# EAGLE board Re.Cycle (EAGLE 5.11)
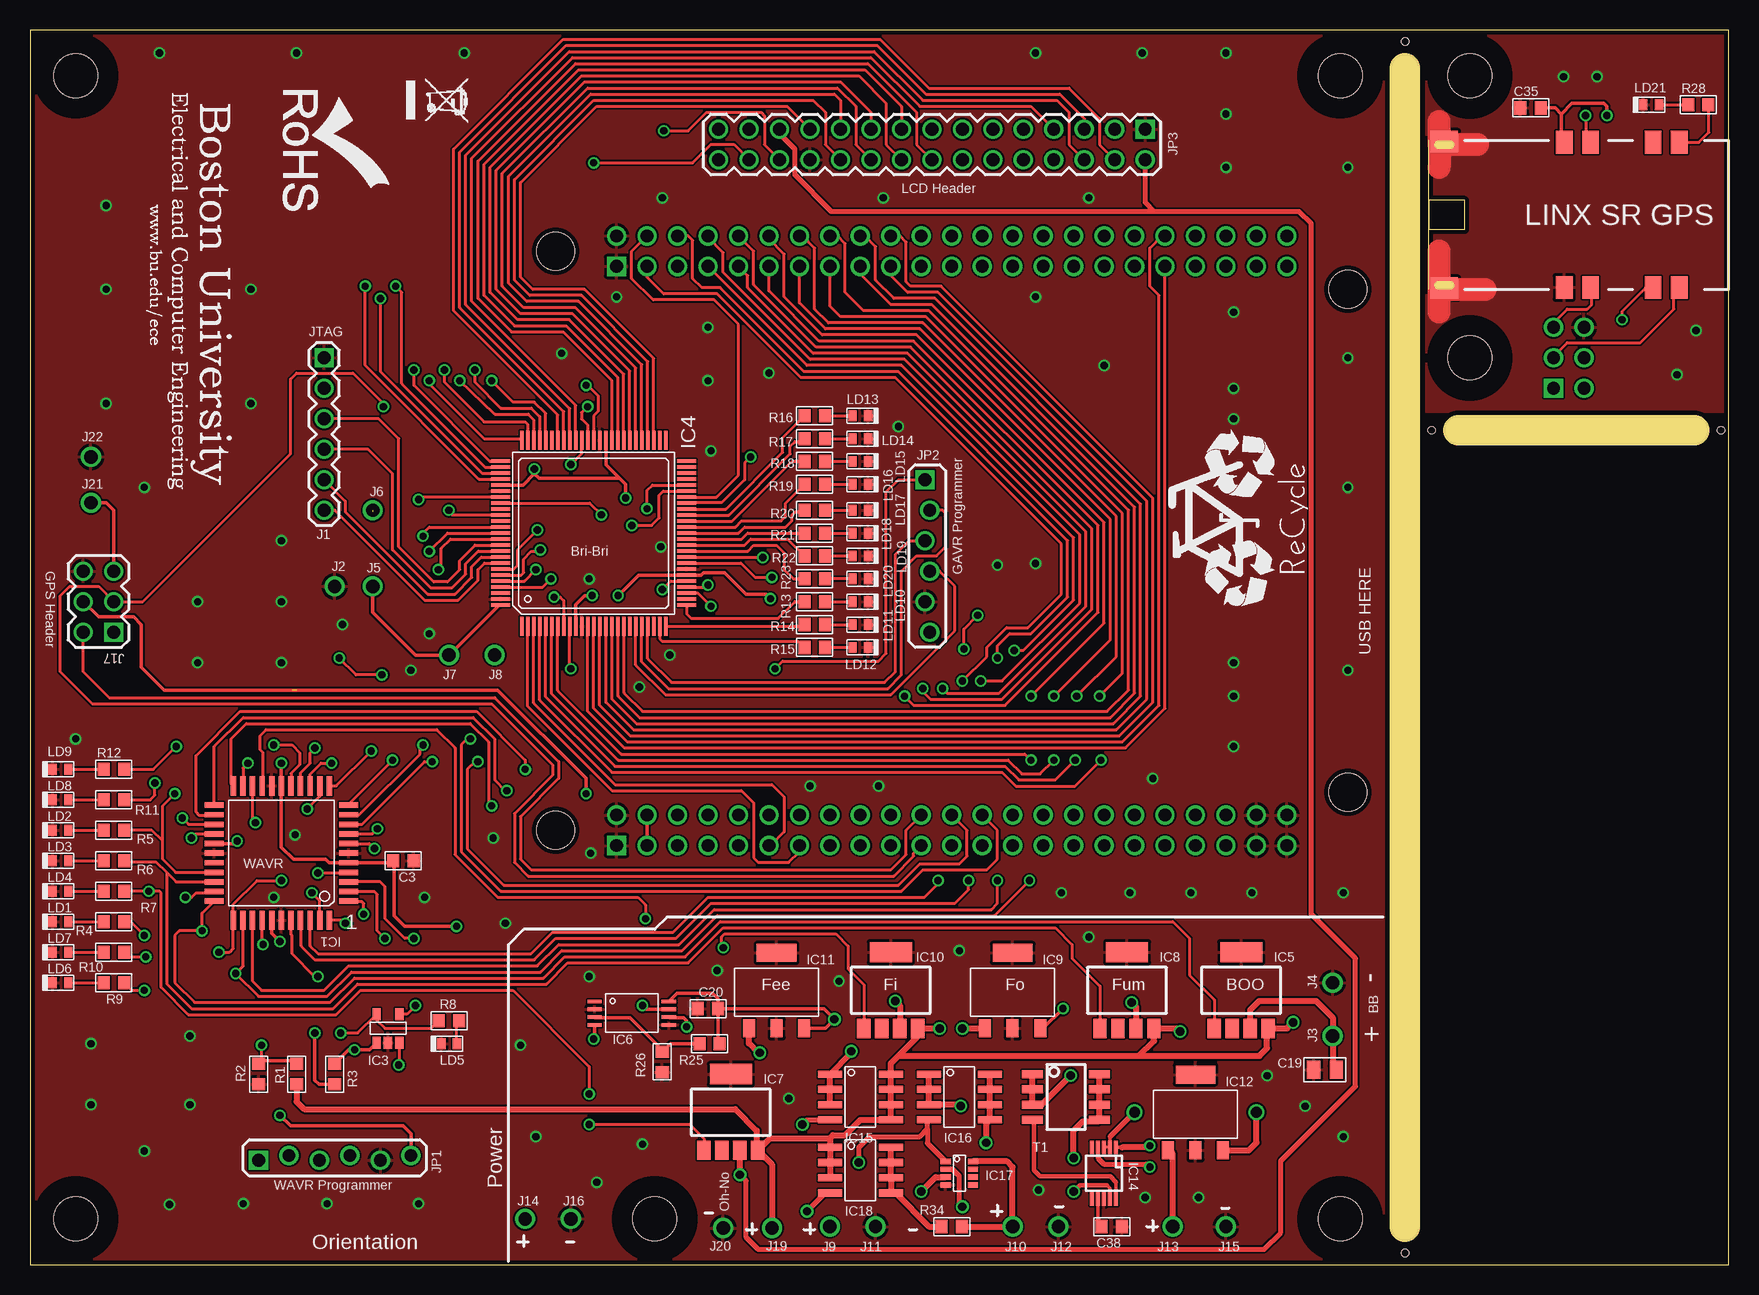
[diagram p4: board, top side]
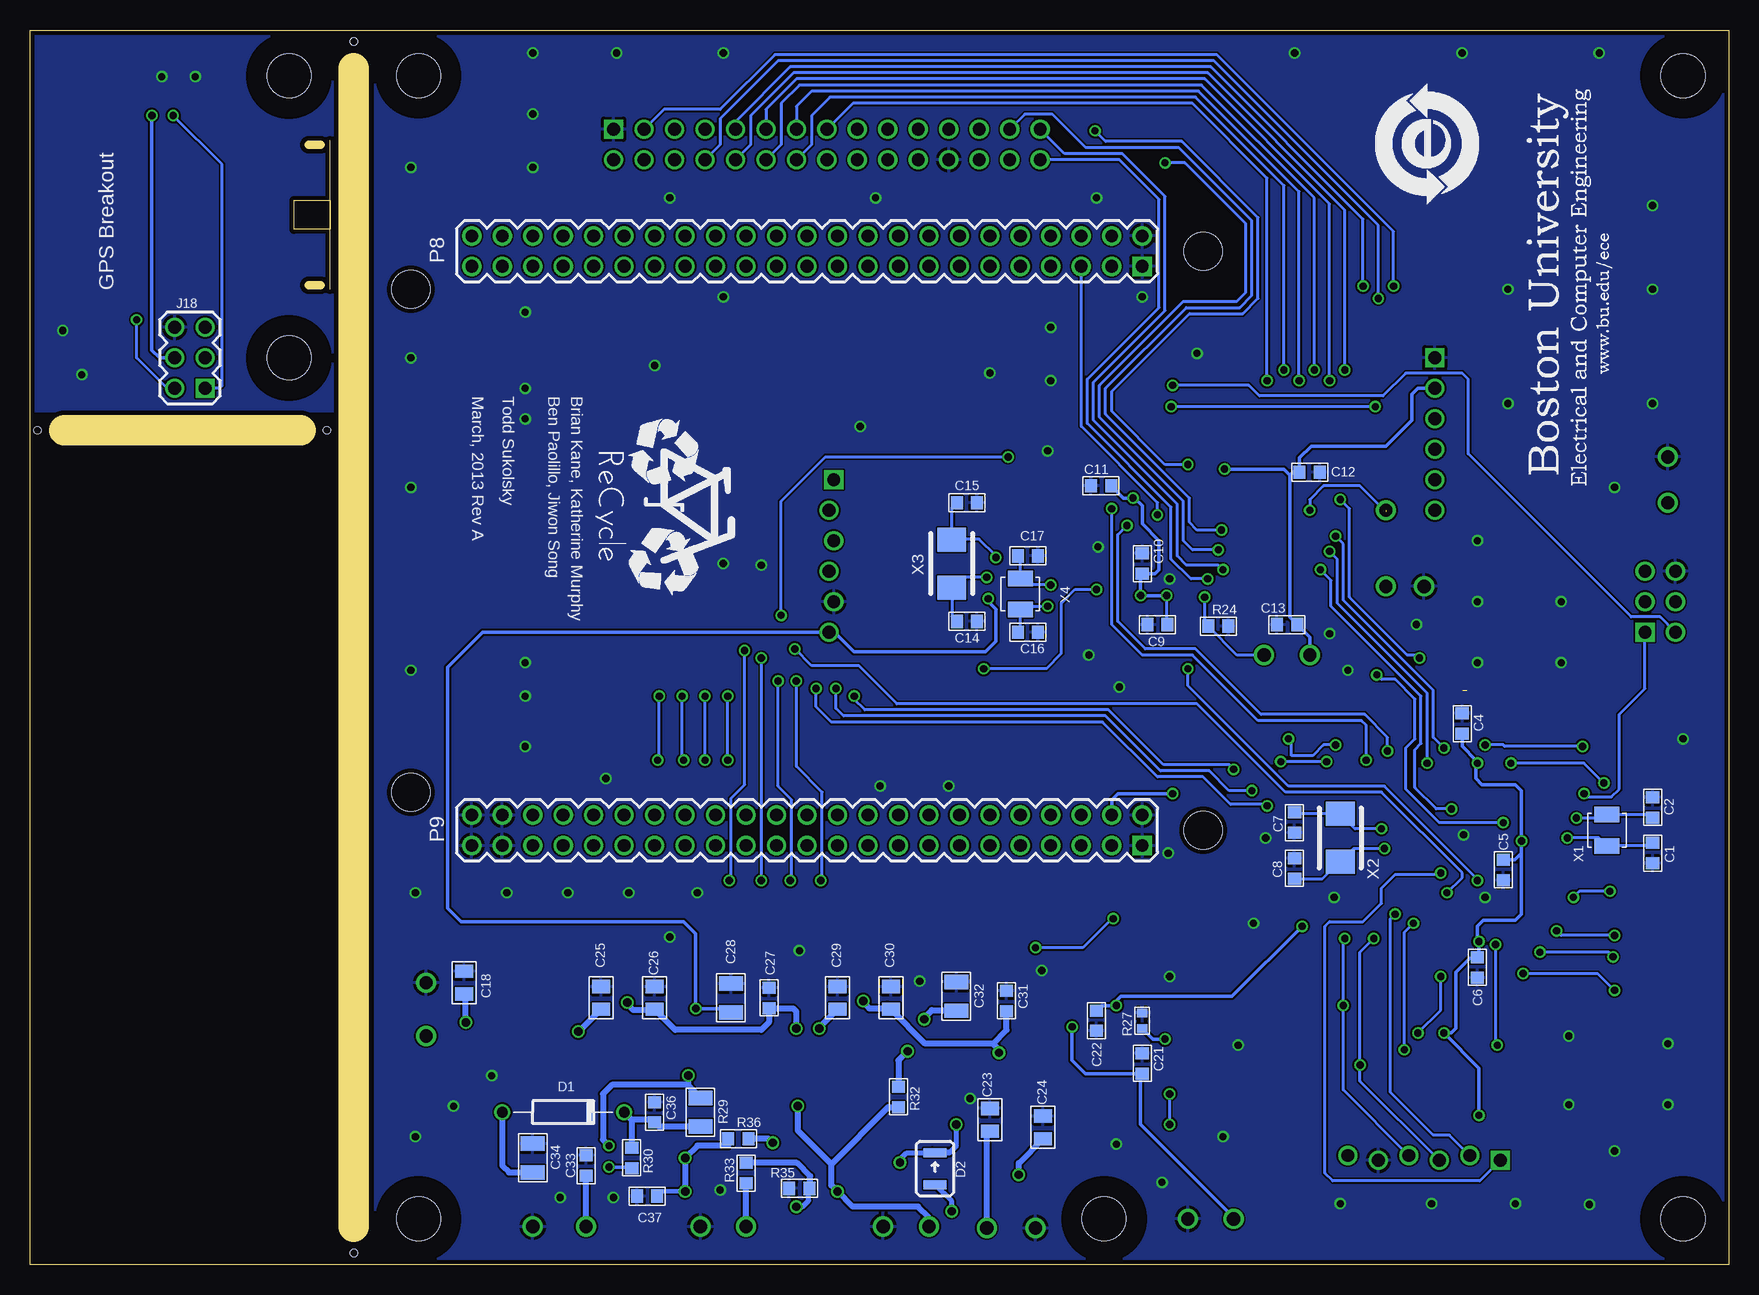
[diagram p5: board, bottom side, seen from below]

Size 141.6 x 102.89 mm. Coordinates in mm from the lower left corner, seen from the top.
Outline: 114.62,99.69 114.62,3.17
Outline: 138.75,69.53 119.06,69.53
Outline: 0,0 141.6,0 141.6,102.89 0,102.89 0,0
Copper layers (1*16): Top 0.0356mm / dielectric 1.5011mm / Bottom 0.0356mm
Design rules "oshPark": minimum track width 6mil, minimum drill 13mil, track to track 6mil, track to pad 6mil, pad to pad 6mil, via to via 6mil, smd to smd 6mil, copper to edge 15mil, drill to drill 6mil, minimum pad ring 7mil, minimum via ring 7mil, stop-mask expansion 4mil, vias tented up to drill 0mil, thermal gap 10mil
Holes 0.6 mm at 116.84,69.53 140.97,69.53 114.62,101.92 114.62,0.95

## Footprints (pad centres in the part's own frame; a part is rotated, then mirrored left to right if it is on the bottom)
C0603 = smd 1 x 1.1: 1 -0.85,0; 2 0.85,0
C0805 = smd 1.1 x 1.5: 1 -0.95,0; 2 0.95,0
C1206 = smd 1.2 x 2: 1 -1.2,0; 2 1.2,0
DO35 = drill 0.889 round: A 5.08,0; C -5.08,0
DO-213AC = smd 0.762 x 1.905: 1 -1.333,0; 2 1.333,0
FOOT#6 = hole 3.658: 0,0
TQFP44 = smd 1.6 x 0.45: 1 -5.6,4; 2 -5.6,3.2; 3 -5.6,2.4; 4 -5.6,1.6; 5 -5.6,0.8; 6 -5.6,0; 7 -5.6,-0.8; 8 -5.6,-1.6; 9 -5.6,-2.4; 10 -5.6,-3.2; 11 -5.6,-4; 23 5.6,-4; 24 5.6,-3.2; 25 5.6,-2.4; 26 5.6,-1.6; 27 5.6,-0.8; 28 5.6,0; 29 5.6,0.8; 30 5.6,1.6; 31 5.6,2.4; 32 5.6,3.2; 33 5.6,4 | smd 0.45 x 1.6: 12 -4,-5.6; 13 -3.2,-5.6; 14 -2.4,-5.6; 15 -1.6,-5.6; 16 -0.8,-5.6; 17 0,-5.6; 18 0.8,-5.6; 19 1.6,-5.6; 20 2.4,-5.6; 21 3.2,-5.6; 22 4,-5.6; 34 4,5.6; 35 3.2,5.6; 36 2.4,5.6; 37 1.6,5.6; 38 0.8,5.6; 39 0,5.6; 40 -0.8,5.6; 41 -1.6,5.6; 42 -2.4,5.6; 43 -3.2,5.6; 44 -4,5.6
BEAGLE_BONE_CAPE = drill 1.067 square: P8_1 -55.88,48.26; P9_1 -55.88,0 | drill 1.067 round: P8_2 -55.88,50.8; P8_3 -53.34,48.26; P8_4 -53.34,50.8; P8_5 -50.8,48.26; P8_6 -50.8,50.8; P8_7 -48.26,48.26; P8_8 -48.26,50.8; P8_9 -45.72,48.26; P8_10 -45.72,50.8; P8_11 -43.18,48.26; P8_12 -43.18,50.8; P8_13 -40.64,48.26; P8_14 -40.64,50.8; P8_15 -38.1,48.26; P8_16 -38.1,50.8; P8_17 -35.56,48.26; P8_18 -35.56,50.8; P8_19 -33.02,48.26; P8_20 -33.02,50.8; P8_21 -30.48,48.26; P8_22 -30.48,50.8; P8_23 -27.94,48.26; P8_24 -27.94,50.8; P8_25 -25.4,48.26; P8_26 -25.4,50.8; P8_27 -22.86,48.26; P8_28 -22.86,50.8; P8_29 -20.32,48.26; P8_30 -20.32,50.8; P8_31 -17.78,48.26; P8_32 -17.78,50.8; P8_33 -15.24,48.26; P8_34 -15.24,50.8; P8_35 -12.7,48.26; P8_36 -12.7,50.8; P8_37 -10.16,48.26; P8_38 -10.16,50.8; P8_39 -7.62,48.26; P8_40 -7.62,50.8; P8_41 -5.08,48.26; P8_42 -5.08,50.8; P8_43 -2.54,48.26; P8_44 -2.54,50.8; P8_45 0,48.26; P8_46 0,50.8; P9_2 -55.88,2.54; P9_3 -53.34,0; P9_4 -53.34,2.54; P9_5 -50.8,0; P9_6 -50.8,2.54; P9_7 -48.26,0; P9_8 -48.26,2.54; P9_9 -45.72,0; P9_10 -45.72,2.54; P9_11 -43.18,0; P9_12 -43.18,2.54; P9_13 -40.64,0; P9_14 -40.64,2.54; P9_15 -38.1,0; P9_16 -38.1,2.54; P9_17 -35.56,0; P9_18 -35.56,2.54; P9_19 -33.02,0; P9_20 -33.02,2.54; P9_21 -30.48,0; P9_22 -30.48,2.54; P9_23 -27.94,0; P9_24 -27.94,2.54; P9_25 -25.4,0; P9_26 -25.4,2.54; P9_27 -22.86,0; P9_28 -22.86,2.54; P9_29 -20.32,0; P9_30 -20.32,2.54; P9_31 -17.78,0; P9_32 -17.78,2.54; P9_33 -15.24,0; P9_34 -15.24,2.54; P9_35 -12.7,0; P9_36 -12.7,2.54; P9_37 -10.16,0; P9_38 -10.16,2.54; P9_39 -7.62,0; P9_40 -7.62,2.54; P9_41 -5.08,0; P9_42 -5.08,2.54; P9_43 -2.54,0; P9_44 -2.54,2.54; P9_45 0,0; P9_46 0,2.54 | hole 3.175: -60.96,49.53; 5.08,46.355; 5.08,4.445; -60.96,1.27
SOT23-5 = smd 0.7 x 1: 1 -0.95,-1.2; 2 0,-1.2; 3 0.95,-1.2; 4 0.95,1.2; 5 -0.95,1.2
TQFP100-100A = smd 1.6 x 0.3: 1 -7.75,6; 2 -7.75,5.5; 3 -7.75,5; 4 -7.75,4.5; 5 -7.75,4; 6 -7.75,3.5; 7 -7.75,3; 8 -7.75,2.5; 9 -7.75,2; 10 -7.75,1.5; 11 -7.75,1; 12 -7.75,0.5; 13 -7.75,0; 14 -7.75,-0.5; 15 -7.75,-1; 16 -7.75,-1.5; 17 -7.75,-2; 18 -7.75,-2.5; 19 -7.75,-3; 20 -7.75,-3.5; 21 -7.75,-4; 22 -7.75,-4.5; 23 -7.75,-5; 24 -7.75,-5.5; 25 -7.75,-6; 51 7.75,-6; 52 7.75,-5.5; 53 7.75,-5; 54 7.75,-4.5; 55 7.75,-4; 56 7.75,-3.5; 57 7.75,-3; 58 7.75,-2.5; 59 7.75,-2; 60 7.75,-1.5; 61 7.75,-1; 62 7.75,-0.5; 63 7.75,0; 64 7.75,0.5; 65 7.75,1; 66 7.75,1.5; 67 7.75,2; 68 7.75,2.5; 69 7.75,3; 70 7.75,3.5; 71 7.75,4; 72 7.75,4.5; 73 7.75,5; 74 7.75,5.5; 75 7.75,6 | smd 0.3 x 1.6: 26 -6,-7.75; 27 -5.5,-7.75; 28 -5,-7.75; 29 -4.5,-7.75; 30 -4,-7.75; 31 -3.5,-7.75; 32 -3,-7.75; 33 -2.5,-7.75; 34 -2,-7.75; 35 -1.5,-7.75; 36 -1,-7.75; 37 -0.5,-7.75; 38 0,-7.75; 39 0.5,-7.75; 40 1,-7.75; 41 1.5,-7.75; 42 2,-7.75; 43 2.5,-7.75; 44 3,-7.75; 45 3.5,-7.75; 46 4,-7.75; 47 4.5,-7.75; 48 5,-7.75; 49 5.5,-7.75; 50 6,-7.75; 76 6,7.75; 77 5.5,7.75; 78 5,7.75; 79 4.5,7.75; 80 4,7.75; 81 3.5,7.75; 82 3,7.75; 83 2.5,7.75; 84 2,7.75; 85 1.5,7.75; 86 1,7.75; 87 0.5,7.75; 88 0,7.75; 89 -0.5,7.75; 90 -1,7.75; 91 -1.5,7.75; 92 -2,7.75; 93 -2.5,7.75; 94 -3,7.75; 95 -3.5,7.75; 96 -4,7.75; 97 -4.5,7.75; 98 -5,7.75; 99 -5.5,7.75; 100 -6,7.75
SOT223-5 = smd 1.1 x 1.6: 1 -2.25,-3.175; 2 -0.75,-3.175; 3 0.75,-3.175; 4 2.25,-3.175 | smd 3.5 x 1.7: TAB 0,3.175
TSSOP8 = smd 0.3 x 1.2: 1 -0.975,-3.1; 2 -0.325,-3.1; 3 0.325,-3.1; 4 0.975,-3.1; 5 0.975,3.1; 6 0.325,3.1; 7 -0.325,3.1; 8 -0.975,3.1
SOT223 = smd 1 x 1.5: 1 -2.3,0; 2 0,0; 3 2.3,0 | smd 3.3 x 1.5: TAB 0,6.3
SR-GPS = smd 1.9 x 1.4: 1 0.15,-11.3; 2 0.15,-13.5; 3 0.15,-18.7; 4 0.15,-20.9; 5 12.25,-20.9; 6 12.25,-18.7; 7 12.25,-13.5; 8 12.25,-11.3 | smd 1.8 x 2.3: 9 12.3,-1.3; 10 0.1,-1.3
MSOP10-UN = smd 0.33 x 1.1: 1 -1,-2.15; 2 -0.5,-2.15; 3 0,-2.15; 4 0.5,-2.15; 5 1,-2.15; 6 1,2.15; 7 0.5,2.15; 8 0,2.15; 9 -0.5,2.15; 10 -1,2.15
SO8 = smd 2 x 0.6: 1 -2.54,1.905; 2 -2.54,0.635; 3 -2.54,-0.635; 4 -2.54,-1.905; 5 2.54,-1.905; 6 2.54,-0.635; 7 2.54,0.635; 8 2.54,1.905
SOT23-8 = smd 0.45 x 0.85: 1 -0.975,-1.137; 2 -0.325,-1.137; 3 0.325,-1.137; 4 0.975,-1.137; 5 0.975,1.137; 6 0.325,1.137; 7 -0.325,1.137; 8 -0.975,1.137
HDR-1X6 = drill 1.067 square: 1 0,6.35 | drill 1.067 round: 2 0,3.81; 3 0,1.27; 4 0,-1.27; 5 0,-3.81; 6 0,-6.35
18AWG-SOLDERPOINT = drill 1.1 pad 1.676 round: 1 0,0
HDR-2X3 = drill 1.067 square: 1 -1.27,2.54 | drill 1.067 round: 2 1.27,2.54; 3 -1.27,0; 4 1.27,0; 5 -1.27,-2.54; 6 1.27,-2.54
HDR-1X6_OFFSET = drill 1.067 square: 1 -0.203,6.35 | drill 1.067 round: 2 0.203,3.81; 3 -0.203,1.27; 4 0.203,-1.27; 5 -0.203,-3.81; 6 0.203,-6.35
HDR-2X15 = drill 1.067 square: 1 -1.27,19.05 | drill 1.067 round: 2 1.27,19.05; 3 -1.27,16.51; 4 1.27,16.51; 5 -1.27,13.97; 6 1.27,13.97; 7 -1.27,11.43; 8 1.27,11.43; 9 -1.27,8.89; 10 1.27,8.89; 11 -1.27,6.35; 12 1.27,6.35; 13 -1.27,3.81; 14 1.27,3.81; 15 -1.27,1.27; 16 1.27,1.27; 17 -1.27,-1.27; 18 1.27,-1.27; 19 -1.27,-3.81; 20 1.27,-3.81; 21 -1.27,-6.35; 22 1.27,-6.35; 23 -1.27,-8.89; 24 1.27,-8.89; 25 -1.27,-11.43; 26 1.27,-11.43; 27 -1.27,-13.97; 28 1.27,-13.97; 29 -1.27,-16.51; 30 1.27,-16.51
D0402 = smd 0.7 x 0.9: A 0.65,0; C -0.65,0
R0603 = smd 1 x 1.1: 1 -0.85,0; 2 0.85,0
R0402 = smd 0.7 x 0.9: 1 -0.65,0; 2 0.65,0
R1206 = smd 1.2 x 2: 1 -1.2,0; 2 1.2,0
SOIC8 = smd 0.65 x 1.75: 1 -1.905,-2.8; 2 -0.635,-2.8; 3 0.635,-2.8; 4 1.905,-2.8; 5 1.905,2.8; 6 0.635,2.8; 7 -0.635,2.8; 8 -1.905,2.8
ABS07 = smd 1.3 x 2.1: 1 -1.3,0; 2 1.3,0
TXC-7A-SERIES = smd 2 x 2.4: P$1 -2,0; P$2 2,0

## Placement (x,y rotation side)
C1  6pF  [C0603]  6.35,34.29 270 bottom
C2  6pF  [C0603]  6.35,38.1 90 bottom
C3  4.7uF  [C0603]  31.11,33.66 0 top
C4  .1uF  [C0603]  22.23,45.09 90 bottom
C5  .1uF  [C0603]  18.8,32.89 270 bottom
C6  .1uF  [C0603]  20.95,24.77 270 bottom
C7  18pF  [C0603]  36.2,36.83 270 bottom
C8  18pF  [C0603]  36.2,33.02 90 bottom
C9  4.7uF  [C0603]  47.62,53.34 180 bottom
C10  .1uF  [C0603]  48.9,58.42 90 bottom
C11  .1uF  [C0603]  52.32,64.9 180 bottom
C12  .1uF  [C0603]  34.92,66.04 0 bottom
C13  .1uF  [C0603]  36.83,53.34 180 bottom
C14  18pF  [C0603]  63.5,53.59 0 bottom
C15  18pF  [C0603]  63.5,63.5 0 bottom
C16  6pF  [C0603]  58.42,52.7 0 bottom
C17  6pF  [C0603]  58.42,59.05 0 bottom
C18  10uF  [C0805]  105.41,23.5 90 bottom
C19  10uF  [C0805]  107.95,16.26 180 top
C20  .1uF  [C0603]  56.52,21.34 180 top
C21  .1uF  [C0603]  48.9,16.76 90 bottom
C22  .1uF  [C0603]  52.7,20.32 270 bottom
C23  10uF  [C0805]  61.59,12.06 90 bottom
C24  10uF  [C0805]  57.15,11.43 90 bottom
C25  10uF  [C0805]  93.98,22.23 90 bottom
C26  10uF  [C0805]  89.53,22.23 90 bottom
C27  1uF  [C0603]  80.01,22.23 90 bottom
C28  47uF  [C1206]  83.19,22.23 90 bottom
C29  10uF  [C0805]  74.3,22.23 90 bottom
C30  10uF  [C0805]  69.85,22.23 90 bottom
C31  1uF  [C0603]  60.2,21.97 90 bottom
C32  47uF  [C1206]  64.39,22.35 90 bottom
C33  1uF  [C0603]  95.25,8.26 90 bottom
C34  47uF  [C1206]  99.69,8.89 90 bottom
C35  .1uF  [C0603]  125.09,96.39 180 top
C36  4.7uF  [C0603]  89.53,12.7 90 bottom
C37  4.7uF  [C0603]  90.17,5.71 180 bottom
C38  4.7uF  [C0603]  90.17,3.17 0 top
D1  ZENER-DO35  [DO35]  97.16,12.7 180 bottom
D2  ZENER-213AC  [DO-213AC]  66.17,8 90 bottom
F1  FOOT  [FOOT#6]  120.02,75.56 0 top
F2  FOOT  [FOOT#6]  120.02,99.06 0 top
F5  FOOT  [FOOT#6]  3.81,3.81 0 top
F6  FOOT  [FOOT#6]  52.07,3.81 0 top
F7  FOOT  [FOOT#6]  109.22,3.81 0 top
F8  FOOT  [FOOT#6]  109.22,99.08 0 top
F10  FOOT  [FOOT#6]  3.81,99.08 0 top
IC1  ATMEGA1284P-AU  [TQFP44]  20.95,34.29 180 top
IC2  BEAGLE_BONE_CAPE-HEADER_ONLY  [BEAGLE_BONE_CAPE]  104.78,34.92 0 top
IC3  LM95071  [SOT23-5]  29.84,19.68 0 top
IC4  ATMEGA2560-16AU  [TQFP100-100A]  46.99,60.96 90 top
IC5  LP38692  [SOT223-5]  100.97,22.86 0 top
IC6  TPS2110  [TSSOP8]  50.16,20.95 270 top
IC7  LP38692  [SOT223-5]  58.42,12.7 0 top
IC8  LP38692  [SOT223-5]  91.44,22.86 0 top
IC9  LM3940  [SOT223]  81.92,19.68 0 top
IC10  LP38692  [SOT223-5]  71.75,22.86 0 top
IC11  LM3940  [SOT223]  62.23,19.68 0 top
IC12  LM2940-SOT223  [SOT223]  97.16,9.53 0 top
IC13  SR-GPS-SR-GPS  [SR-GPS]  116.59,81.28 90 top
IC14  MCP73842  [MSOP10-UN]  89.53,7.62 180 top
IC15  IRF9335-SO8  [SO8]  69.22,13.97 0 top
IC16  IRF8707  [SO8]  77.47,13.97 0 top
IC17  LTC6702  [SOT23-8]  77.47,7.62 270 top
IC18  IRF8707  [SO8]  69.22,7.87 0 top
J1  HDR-1X6  [HDR-1X6]  24.51,69.22 0 top
J2  HDR-1X1-18AWG_WIRE  [18AWG-SOLDERPOINT]  25.4,56.52 0 top
J3  HDR-1X1-18AWG_WIRE  [18AWG-SOLDERPOINT]  108.58,19.05 90 top
J4  HDR-1X1-18AWG_WIRE  [18AWG-SOLDERPOINT]  108.58,23.5 90 top
J5  HDR-1X1-18AWG_WIRE  [18AWG-SOLDERPOINT]  28.57,56.52 0 top
J6  HDR-1X1-18AWG_WIRE  [18AWG-SOLDERPOINT]  28.57,62.87 0 top
J7  HDR-1X1-18AWG_WIRE  [18AWG-SOLDERPOINT]  34.92,50.8 0 top
J8  HDR-1X1-18AWG_WIRE  [18AWG-SOLDERPOINT]  38.73,50.8 0 top
J9  HDR-1X1-18AWG_WIRE  [18AWG-SOLDERPOINT]  66.67,3.17 90 top
J10  HDR-1X1-18AWG_WIRE  [18AWG-SOLDERPOINT]  81.92,3.17 90 top
J11  HDR-1X1-18AWG_WIRE  [18AWG-SOLDERPOINT]  70.48,3.17 90 top
J12  HDR-1X1-18AWG_WIRE  [18AWG-SOLDERPOINT]  85.72,3.17 90 top
J13  HDR-1X1-18AWG_WIRE  [18AWG-SOLDERPOINT]  95.25,3.17 90 top
J14  HDR-1X1-18AWG_WIRE  [18AWG-SOLDERPOINT]  41.27,3.81 90 top
J15  HDR-1X1-18AWG_WIRE  [18AWG-SOLDERPOINT]  99.69,3.17 90 top
J16  HDR-1X1-18AWG_WIRE  [18AWG-SOLDERPOINT]  45.09,3.81 90 top
J17  HDR-2X3  [HDR-2X3]  5.71,55.24 180 top
J18  HDR-2X3  [HDR-2X3]  128.27,75.56 180 bottom
J19  HDR-1X1-18AWG_WIRE  [18AWG-SOLDERPOINT]  61.85,3.05 0 top
J20  HDR-1X1-18AWG_WIRE  [18AWG-SOLDERPOINT]  57.78,3.05 0 top
J21  HDR-1X1-18AWG_WIRE  [18AWG-SOLDERPOINT]  5.08,63.5 0 top
J22  HDR-1X1-18AWG_WIRE  [18AWG-SOLDERPOINT]  5.08,67.31 0 top
JP1  HDR-1X6-OFFSET  [HDR-1X6_OFFSET]  25.4,8.89 90 top
JP2  HDR-1X6-OFFSET  [HDR-1X6_OFFSET]  74.8,59.05 0 top
JP3  HDR-2X15  [HDR-2X15]  73.91,93.34 270 top
LD1  LED-S0402  [D0402]  2.54,28.57 0 top
LD2  LED-S0402  [D0402]  2.54,36.2 0 top
LD3  LED-S0402  [D0402]  2.54,33.66 0 top
LD4  LED-S0402  [D0402]  2.54,31.11 0 top
LD5  LED-S0402  [D0402]  34.92,18.41 0 top
LD6  LED-S0402  [D0402]  2.54,23.5 0 top
LD7  LED-S0402  [D0402]  2.54,26.04 0 top
LD8  LED-S0402  [D0402]  2.54,38.73 0 top
LD9  LED-S0402  [D0402]  2.54,41.27 0 top
LD10  LED-S0402  [D0402]  69.22,55.24 180 top
LD11  LED-S0402  [D0402]  69.22,53.34 180 top
LD12  LED-S0402  [D0402]  69.22,51.44 180 top
LD13  LED-S0402  [D0402]  69.22,70.74 180 top
LD14  LED-S0402  [D0402]  69.22,68.83 180 top
LD15  LED-S0402  [D0402]  69.22,66.93 180 top
LD16  LED-S0402  [D0402]  69.22,65.02 180 top
LD17  LED-S0402  [D0402]  69.22,62.87 180 top
LD18  LED-S0402  [D0402]  69.22,60.96 180 top
LD19  LED-S0402  [D0402]  69.22,59.05 180 top
LD20  LED-S0402  [D0402]  69.22,57.15 180 top
LD21  LED-S0402  [D0402]  135.13,96.65 0 top
LG2  RECYCLE_LOGO  [RECYCLE_LOGO]  107.44,61.59 90 top
LG3  RECYCLE_LOGO  [RECYCLE_LOGO]  95.38,63.75 270 bottom
LOGO1  BU_LOGO-CUSTOM_1.5  [BULOGO3_1.5SCALE]  9.53,97.79 270 top
LOGO2  ROHS-CHINA  [ROHS_CHINA_LOGO]  20.07,87.38 90 bottom
LOGO3  BU_LOGO-CUSTOM_1.5  [BULOGO3_1.5SCALE]  9.53,64.77 90 bottom
LOGO4  WEEE-S  [WEEE_LOGO]  30.61,98.3 270 top
LOGO?1  ROHS-CHECK-0.4  [ROHS_CHECK_LOGO]  21.08,97.92 270 top
R1  100k  [R0603]  22.23,15.88 270 top
R2  14.7k  [R0603]  19.05,15.88 90 top
R3  10k  [R0603]  25.4,15.88 270 top
R4  255  [R0603]  6.99,28.57 0 top
R5  255  [R0603]  6.99,36.2 0 top
R6  255  [R0603]  6.99,33.66 0 top
R7  255  [R0603]  6.99,31.11 0 top
R8  255  [R0603]  34.92,20.32 180 top
R9  255  [R0603]  6.99,23.5 0 top
R10  255  [R0603]  6.99,26.04 0 top
R11  255  [R0603]  6.99,38.73 180 top
R12  255  [R0603]  6.99,41.27 180 top
R13  255  [R0603]  65.41,55.24 180 top
R14  255  [R0603]  65.41,53.34 180 top
R15  255  [R0603]  65.41,51.44 180 top
R16  255  [R0603]  65.41,70.74 180 top
R17  255  [R0603]  65.41,68.83 180 top
R18  255  [R0603]  65.41,66.93 180 top
R19  255  [R0603]  65.41,65.02 180 top
R20  255  [R0603]  65.41,62.87 180 top
R21  255  [R0603]  65.41,60.96 180 top
R22  255  [R0603]  65.41,59.05 180 top
R23  255  [R0603]  65.41,57.15 180 top
R24  10k  [R0603]  42.55,53.21 180 bottom
R25  10k  [R0603]  56.64,18.41 0 top
R26  10k  [R0603]  52.7,16.89 90 top
R27  470  [R0402]  48.9,20.32 270 bottom
R28  255  [R0603]  139.06,96.65 180 top
R29  60mOhm  [R1206]  85.72,12.7 90 bottom
R30  6.19k  [R0603]  91.44,8.89 90 bottom
R32  100  [R0603]  69.22,13.97 90 bottom
R33  1k  [R0603]  81.92,7.62 270 bottom
R34  100  [R0603]  76.83,3.17 180 top
R35  2.1k  [R0603]  77.47,6.35 0 bottom
R36  100  [R0603]  82.55,10.48 180 bottom
T1  NDS8434NDS8434  [SOIC8]  86.36,13.97 270 top
X1  XTAL-ABS07  [ABS07]  10.16,36.2 90 bottom
X2  XTAL-TXC-7A  [TXC-7A-SERIES]  32.38,35.56 270 bottom
X3  XTAL-TXC-7A  [TXC-7A-SERIES]  64.77,58.42 90 bottom
X4  XTAL-ABS07  [ABS07]  59.05,55.88 90 bottom

## Tracks (layer width: path | path; a pad name or v marks a point on that pad's centre or on a via)
BACKUP_COINCELL  (via drill 0.6)
  Top 0.305: v54.74,19.81 54.74,20.32 54.48,20.57 53.32,20.57 IC6.6
  Bottom 0.305: v54.74,19.81 54.74,17.02 53.63,15.91 C21.1 49.02,15.79 49.02,11.68 41.27,3.94 J14.1
BATT_ADC  (via drill 0.6)
  Top 0.254: IC1.37 19.36,26.75 v19.43,26.67 | v19.3,18.29 19.3,16.98 R2.2
  Top 0.305: 19.3,16.98 21.97,16.98 R1.1
  Bottom 0.254: v19.43,26.67 19.43,18.41 v19.3,18.29
BB_EN  (via drill 0.6)
  Top 0.254: IC5.1 98.72,22.06 96.65,24.13 96.65,27.18 95.25,28.57 57.53,28.57 54.61,25.65 44.58,25.65 42.8,23.88 27.05,23.88 25.02,21.84 13.72,21.84 12.06,23.5 12.06,27.43 12.45,27.81 v14.35,27.81 14.35,29.29 IC1.33 | R4.2 8.38,28.57 v9.53,27.43
  Bottom 0.254: v9.53,27.43 13.97,27.43 v14.35,27.81
BB_INT  (via drill 0.6)
  Top 0.254: v17.14,24.26 17.75,24.87 IC1.35 17.78,28.66 17.78,24.89 v17.14,24.26 | v9.53,22.86 8.47,22.86 R9.2 | v17.14,24.26 19.05,22.35 24.77,22.35 26.8,24.38 42.55,24.38 44.32,26.16 54.36,26.16 57.28,29.08 80.39,29.08 v83.31,32 | v82.04,51.18 82.8,51.18 87,55.37 87,60.58 72.64,74.93 64.77,74.93 IC2.P8_7
  Bottom 0.254: v17.14,24.26 10.92,24.26 v9.53,22.86 | v83.31,32 83.19,32.13 83.19,38.86 82.04,40.01 v82.04,51.18
BONE_3V3  (via drill 0.6)  (1 unrouted)
  Top 0.305: IC2.P9_4 IC2.P9_3 | v46.35,39.24 46.35,40.51 38.99,47.88 21.84,47.88 | 22.23,47.88 11.18,47.88 9.27,49.78 9.27,53.34 8.64,53.98 5.71,53.98 J17.4
  Bottom 0.305: IC2.P9_4 51.44,38.73 50.93,39.24 v46.35,39.24
BONE_5V
  Top 0.508: IC5.3 101.72,21.22 102.47,21.97 107.19,21.97 108.58,20.57 J3.1 108.58,16.57 C19.1
BONE_INT/GAVRO  (via drill 0.6)
  Top 0.254: IC4.83 46.65,63.46 v47.62,62.48
  Bottom 0.254: IC2.P8_5 53.98,69.85 47.62,63.5 v47.62,62.48
BONE_INT/WAVRO  (via drill 0.6)
  Top 0.254: IC1.36 18.54,28.68 18.54,23.62 19.3,22.86 24.51,22.86 26.54,24.89 42.29,24.89 44.07,26.67 54.1,26.67 57.02,29.59 80.14,29.59 80.64,30.1 v80.64,32 | v80.64,50.55 80.64,51.56 81.66,52.58 83.44,52.58 86.49,55.63 86.49,60.33 72.39,74.42 64.52,74.42 57.53,81.41 56.01,81.41 55.24,82.17 55.24,85.34 54.86,85.72 IC2.P8_6
  Bottom 0.254: v80.64,32 v80.64,50.55
DBG0/STATUS0
  Top 0.254: IC4.42 58.01,62.96 62.74,67.69 62.74,68.92 R16.2
DBG1/STATUS1
  Top 0.254: IC4.41 58.27,62.46 63.37,67.56 63.37,68.2 63.75,68.58 64.3,68.58 R17.2
DBG2/STATUS2
  Top 0.254: IC4.40 58.53,61.96 63.5,66.93 R18.2
DBG3/WAVR_COMM
  Top 0.254: IC4.39 58.79,61.46 59.31,61.98 62.61,61.98 62.99,62.36 62.99,63.46 R19.2
DBG4/BONE_COMM
  Top 0.254: IC4.38 59.05,60.96 59.56,61.47 62.99,61.47 63.5,61.98 63.5,62.48 63.75,62.74 64.43,62.74 R20.2
DBG5/STARTING
  Top 0.254: IC4.37 59.32,60.46 59.82,60.96 R21.2
DBG6/USERDATE
  Top 0.254: IC4.36 59.58,59.96 60.07,60.45 63.16,60.45 R22.2
DBG7/USERTIME
  Top 0.254: IC4.35 59.84,59.46 60.33,59.94 62.23,59.94 62.87,59.31 62.87,57.91 63.63,57.15 R23.2
DBG8
  Top 0.254: IC4.26 54.74,54.23 55.12,53.85 62.36,53.85 63.75,55.24 R13.2
DBG9
  Top 0.254: IC4.25 64.42,53.21 R14.2
DBG10
  Top 0.254: IC4.24 52.49,52.16 52.7,51.94 64.05,51.94 R15.2
DRAIN  (via drill 0.7)
  Top 0.508: IC16.8 IC16.7 IC16.6 IC16.5 79.69,11.75 v79.69,10.16
  Bottom 0.508: R36.1 80.01,10.48 v79.69,10.16
EXT_GPS_BACKUP
  Top 0.254: J18.5 127,78.49 128.14,79.63 129.79,79.63 130.18,80.01 130.18,81.34 IC13.2
EXT_GPS_EN  (via drill 0.6)
  Top 0.254: v129.67,95.76 129.67,93.57 IC13.7
  Bottom 0.254: J18.1 125.86,73.03 125.6,73.28 125.6,91.69 v129.67,95.76
EXT_GPS_GND  (via drill 0.6)
  Top 1.905: IC13.9 117.47,93.58 | 117.47,93.58 117.47,95.25 | 117.47,93.58 117.47,93.34 | 117.47,93.34 117.47,91.44 | 117.47,93.34 120.65,93.34 | 117.47,81.38 IC13.10 | 117.47,81.38 117.47,84.45 | 117.47,81.28 117.47,81.38 | 117.47,79.38 117.47,81.28 | 117.47,81.28 121.28,81.28
  other vias: 137.29,74.17 138.87,77.85 130.62,99 127.83,99
  pour Top: 116.2,102.87 116.2,71.12 141.6,71.12 141.6,102.87
  pour Bottom: 116.2,102.87 116.2,71.12 141.6,71.12 141.6,102.87
EXT_GPS_RX
  Top 0.254: J18.3 127,75.69 128.14,76.83 134.24,76.83 137.03,79.63 137.03,81.36
  Top 0.305: 137.03,81.36 IC13.4
EXT_GPS_TX  (via drill 0.6)
  Top 0.254: v132.72,78.74 132.72,79.44 134.68,81.41 135.26,81.41 IC13.3
  Bottom 0.254: J18.2 130.18,73.03 132.72,75.56 v132.72,78.74
EXT_GPS_VCC3V3  (via drill 0.6)
  Top 0.305: 127.64,95.89 127.64,93.66 IC13.8 | v131.44,95.76 131.44,96.52 131.19,96.77 128.52,96.77 127.64,95.89 | 127.64,95.89 127.13,96.39 C35.1
  Bottom 0.305: J18.4 130.81,75.56 131.44,76.2 v131.44,95.76
GAVR_3V3  (via drill 0.6)
  Top 0.254: IC4.10 45.47,53.23 45.47,54.17
  Top 0.305: IC9.3 84.45,19.68 v86.11,21.34 | v46.86,55.75 46.23,55.75 45.47,54.99 45.47,54.17 | IC4.100 39.09,54.96 J7.1 32.13,50.8 28.57,54.36 J5.1 | v49.02,55.75 50.73,57.46 IC4.31 55.94,57.46 56.13,57.66 57.91,57.66 59.69,55.88 61.34,55.88 v61.72,55.5 | IC4.61 48.01,68.69 48.01,66.67 49.15,65.53 | 42.04,65.91 41.08,64.96 IC4.80 | IC4.80 | v42.04,66.29 42.04,65.91 | 42.04,65.91 42.42,65.53 49.15,65.53 | 49.15,65.53 49.66,65.02 v49.66,63.88
  Bottom 0.254: C9.1 46.86,53.43 v46.86,55.75 | C10.1 49.02,57.44
  Bottom 0.305: v86.11,21.34 83.5,21.34 C28.1 | J7.1 34.92,52.28 C13.1 36.58,53.94 36.58,65.79 | 49.02,57.44 v49.02,55.75 v46.86,55.75 | C10.1 47.84,57.57 47.5,57.91 47.5,60.33 48.9,61.72 48.9,63.25 49.53,63.88 v49.66,63.88 50.46,63.88 C11.1 | v86.11,21.34 85.98,21.46 | v86.11,21.34 86.11,27.56 87.12,28.57 105.66,28.57 106.81,29.72 106.81,49.78 103.89,52.7 JP2.6 74.55,52.7 72.9,51.05 61.98,51.05 61.09,51.94 61.09,54.61 61.72,55.24 v61.72,55.5 | 36.58,65.79 36.32,66.04 C12.1 35.77,67.22 34.8,68.2 28.57,68.2 26.42,70.36 26.42,72.52 25.91,73.03 J1.2 | v42.04,66.29 37.08,66.29 36.58,65.79
GAVR_5V  (via drill 0.7)
  Top 0.508: v77.72,19.68 IC9.1 | IC8.3 92.19,21.48 v91.82,21.84
  Bottom 0.508: C26.1 89.72,21.46 | v77.72,19.68 77.72,21.08 77.98,21.34 79.97,21.34 C27.1 80.01,20.19 80.64,19.56 87.82,19.56 C26.1 | v91.82,21.84 91.82,21.72 91.31,21.21 89.6,21.21 C26.1
GAVR_EN
  Top 0.254: IC8.1 89.19,23.2 86.87,25.53 86.87,26.67 85.47,28.07 57.78,28.07 54.86,25.15 44.83,25.15 43.05,23.37 27.3,23.37 25.27,21.34 13.46,21.34 11.43,23.37 11.43,32.64 | R6.2 7.96,33.53 10.54,33.53 11.43,32.64 | IC1.31 12.18,31.89 11.43,32.64
GAVR_INT  (via drill 0.6)
  Top 0.254: v15.75,26.04 16.64,26.04 16.95,26.35 IC1.34 16.95,30.04 18.92,32 v20.95,32 | v9.65,25.65 8.22,25.65 R10.2 | v45.09,49.66 44.99,49.75 IC4.9
  Bottom 0.254: v15.75,26.04 10.03,26.04 v9.65,25.65 | v20.95,32 20.95,32.13 28.7,39.88 36.7,39.88 45.09,48.26 v45.09,49.66
GAVRI0/WAVRO  (via drill 0.6)
  Top 0.254: IC1.43 24.16,30.33 v23.5,30.99 | 54.78,63.5 IC4.43 | 54.78,63.5 54.74,63.5 | 54.78,63.5 57.66,63.5 59.56,65.41 59.56,66.8 v60.07,67.31 | v77.85,51.31 77.85,52.96 v78.99,54.1
  Bottom 0.254: v23.5,30.99 22.23,32.26 22.23,32.64 28.96,39.37 36.96,39.37 44.32,46.74 69.34,46.74 72.52,49.91 76.45,49.91 v77.85,51.31 | v78.99,54.1 78.99,63.63 75.31,67.31 v60.07,67.31
GAVRI1/BBO
  Top 0.254: IC4.44 57.23,63.96 59.05,65.79 59.05,78.36 57.02,80.39 51.94,80.39 50.16,82.17 50.16,84.45 IC2.P8_4
GENERATOR_IN
  Top 0.508: IC12.1 arc-90 95.25,9.13 J13.1
  Bottom 0.508: J13.1 C33.1
GIO3/BB8_12  (via drill 0.6)
  Top 0.254: v83.44,42.04 82.93,42.55 49.28,42.55 43.99,47.83 IC4.7 | v83.44,47.37 89.53,53.47 89.53,61.85 73.91,77.47 66.04,77.47 62.87,80.64 62.87,84.2 61.59,85.47 IC2.P8_12
  Bottom 0.254: v83.44,42.04 v83.44,47.37
GIO4/BB8_13  (via drill 0.6)
  Top 0.254: v85.34,42.04 84.2,40.89 82.68,40.89 81.53,42.04 49.02,42.04 43.49,47.57 IC4.6 | v85.34,47.37 90.04,52.07 90.04,62.1 74.17,77.98 66.29,77.98 64.14,80.14 IC2.P8_13 64.14,82.8
  Bottom 0.254: v85.34,42.04 v85.34,47.37
GIO5/BB8_14  (via drill 0.6)
  Top 0.254: v87.12,42.04 85.47,40.39 82.42,40.39 81.28,41.53 48.77,41.53 42.99,47.31 IC4.5 | v87.25,47.37 90.55,50.67 90.55,62.36 74.42,78.49 66.55,78.49 65.41,79.63 65.41,84.71 64.39,85.72 IC2.P8_14
  Bottom 0.254: v87.12,42.04 87.25,42.16 v87.25,47.37
GIO6/BB8_15  (via drill 0.6)
  Top 0.254: v89.28,42.04 87.12,39.88 82.17,39.88 81.03,41.02 48.51,41.02 42.49,47.05 IC4.4 | v89.15,47.37 91.06,49.28 91.06,62.61 74.68,78.99 67.56,78.99 66.67,79.88 IC2.P8_15
  Bottom 0.254: v89.28,42.04 89.15,42.16 v89.15,47.37
GIO7/BB8_16
  Top 0.254: IC4.18 49.53,53.17 49.53,47.62 51.05,46.1 89.79,46.1 91.57,47.88 91.57,62.87 74.93,79.5 69.47,79.5 67.94,81.03 67.94,85.09 67.31,85.72 IC2.P8_16
GIO8/BB8_17
  Top 0.254: IC4.17 49.02,53.18 49.02,47.37 50.8,45.59 90.04,45.59 92.08,47.62 92.08,63.12 75.18,80.01 71.75,80.01 69.22,82.55 IC2.P8_17
GIO9/BB8_18
  Top 0.254: IC4.16 48.51,53.19 48.51,47.12 50.55,45.09 90.3,45.09 92.58,47.37 92.58,63.37 75.44,80.52 72.01,80.52 70.48,82.04 70.48,84.84 69.6,85.72 IC2.P8_18
GIO10/BB8_19
  Top 0.254: IC4.15 48.01,53.19 48.01,46.86 50.29,44.58 90.55,44.58 93.09,47.12 93.09,63.63 75.69,81.03 73.15,81.03 71.75,82.42 IC2.P8_19
GIO11/BB8_20
  Top 0.254: IC4.14 47.5,46.61 50.04,44.07 90.81,44.07 93.6,46.86 93.6,63.88 75.95,81.53 73.41,81.53 73.03,81.92 73.03,85.22 72.52,85.72 IC2.P8_20
GND  (via drill 0.6)
  other vias: 63.25,13.84 57.28,24.51 67.44,23.62 77.47,26.16 88.27,27.3 32.89,30.61 46.74,34.29 22.1,35.81 20.32,30.61 46.61,57.15 52.58,59.82 56.77,67.82 80.64,58.29 44.32,75.95 38.61,35.56 6.35,88.27 71.12,88.9 92.71,100.97 99.69,95.89 99.69,100.97 99.69,91.44 83.82,100.97 52.7,88.9 109.86,91.44 109.86,75.56 109.86,64.77 109.86,49.53 100.33,79.38 100.33,73.03 100.33,70.48 100.33,47.37 100.33,50.16 100.33,43.18 83.82,80.64 89.53,74.93 56.52,78.11 56.52,73.66 48.9,80.64 61.59,74.3 72.39,69.85 83.82,58.42 53.34,50.8 70.74,39.88 65.02,39.88 93.6,40.51 85.98,30.99 91.69,30.99 96.77,30.99 101.85,30.99 109.47,30.99 109.47,10.67 106.3,13.21 103.12,15.75 97.41,5.59 92.96,5.59 84.07,6.22 51.05,10.03 47.24,6.86 42.16,10.67 40.89,18.29 39.62,28.45 46.61,24 5.08,18.41 5.08,13.34 9.53,9.46 11.62,5.02 17.78,5.08 24.77,5.08 32.38,5.08 13.34,13.34 13.34,19.05 3.81,43.81 20.95,55.24 31.75,49.53 26.04,53.34 18.41,71.75 18.41,81.28 88.27,88.9 33.27,52.58 50.8,48.13 13.97,50.16 20.95,50.16 13.97,55.24 20.95,60.33 9.53,64.77 6.35,81.28 6.35,71.75 36.2,100.97 22.23,100.97 10.79,100.97
  pour Top: 0,102.89 113.03,102.89 113.03,0 0,0
  pour Bottom: 0,102.89 113.03,102.89 113.03,0 0,0
GPS_BACKUP
  Top 0.305: J21.1 6.35,63.5 6.99,62.87 J17.5
GPS_EN  (via drill 0.6)
  Top 0.254: IC1.30 12.14,32.69 11.05,33.78 11.05,35.31 | 11.05,35.31 11.05,38.23 v12.06,39.24 | R5.2 10.16,36.2 11.05,35.31
  Bottom 0.254: v12.06,39.24 11.81,38.99 9.78,38.99 9.14,39.62 9.14,45.85 6.99,48.01 J17.1
GPS_RX/TX2_BONE  (via drill 0.6)
  Top 0.254: IC2.P9_21 73.66,34.29 73.66,34.04 72.01,32.38 41.53,32.38 40.39,33.53 40.39,37.59 43.56,40.77 43.56,41.66 38.48,46.74 5.21,46.74 2.54,49.4 2.54,55.75 3.3,56.52 5.71,56.52 J17.3 9.4,55.24 21.72,67.56 21.72,73.79 22.23,74.3 26.92,74.3 29.46,71.75 v29.46,71.5 | IC4.64 46.48,69.98 45.97,70.48 45.97,70.99 v46.48,71.5
  Bottom 0.254: v29.46,71.5 v46.48,71.5
GPS_TX/RX2_BONE  (via drill 0.6)
  Top 0.254: IC2.P9_22 73.03,36.2 73.03,34.16 71.75,32.89 41.78,32.89 40.89,33.78 40.89,37.34 44.07,40.51 44.07,41.91 38.73,47.24 6.6,47.24 4.45,49.4 J17.2 | IC4.63 46.99,70.74 47.37,71.12 47.37,72.39 46.48,73.28 v46.35,73.28
  Bottom 0.254: v46.35,73.28 40.01,73.28 39.12,72.39 28.83,72.39 26.92,74.3 22.23,74.3 21.72,73.79 21.72,67.56 8.13,53.98 5.71,53.98 J17.2
HR_SAMPLE  (via drill 0.6)  (1 unrouted)
  Top 0.254: v34.92,62.87 34.92,62.74 35.18,62.48 39.22,62.48 IC4.85
  Bottom 0.254: 28.57,62.74 30.73,64.9 33.78,64.9 34.92,63.75 v34.92,62.87
LCD_5V  (via drill 0.7)
  Top 0.406: v59.18,7.49 59.69,6.99 59.69,2.29 60.71,1.27 102.87,1.27 104.27,2.67 104.27,8.64 110.49,14.86 110.49,25.53 106.81,29.21 106.81,86.74 105.79,87.76 93.85,87.76 93.73,87.76 | 93.73,87.76 92.96,88.52 JP3.2 | JP3.25 62.48,94.24 63.75,92.96 63.75,90.81 66.8,87.76 93.73,87.76
  Top 0.508: IC7.3 59.17,7.5 v59.18,7.49
  Bottom 0.508: v59.18,7.49 59.18,8.45 C24.1
LCD_BL/EN  (via drill 0.6)
  Top 0.254: IC4.65 45.99,67.58 v45.09,66.67 | v52.83,94.49 54.86,94.49 56.39,96.01 60.96,96.01 61.21,95.76 61.21,93.34 JP3.26
  Bottom 0.254: v45.09,66.67 46.99,66.67 51.44,71.12 51.44,72.77 44.96,79.25 40.51,79.25 39.24,80.52 39.24,87.25 45.59,93.6 51.94,93.6 v52.83,94.49
LCD_CS
  Top 0.254: IC4.67 44.99,71.34 36.32,80.01 36.32,92.46 44.96,101.09 70.36,101.09 74.42,97.03 85.6,97.03 86.61,96.01 86.61,93.34 JP3.6
LCD_DB0  (via drill 0.6)
  Top 0.254: IC4.78 37.67,65.96 29.21,74.42 v29.21,80.52
  Bottom 0.254: v29.21,80.52 29.21,86.61 42.93,100.33 79.25,100.33 84.07,95.5 84.07,93.34 JP3.8
LCD_DB1  (via drill 0.6)
  Top 0.254: IC4.77 37.93,66.46 30.99,73.41 30.99,81.03 v30.48,81.53
  Bottom 0.254: v30.48,81.53 30.48,87.12 43.18,99.82 78.23,99.82 82.8,95.25 JP3.9
LCD_DB2  (via drill 0.6)
  Top 0.254: IC4.76 38.32,66.96 32,73.28 v32,74.55
  Bottom 0.254: v32,74.55 32,87.88 43.43,99.31 77.98,99.31 81.53,95.76 81.53,93.34 JP3.10
LCD_DB3  (via drill 0.6)
  Top 0.254: IC4.75 40.99,68.74 40.89,68.83 37.85,68.83 33.27,73.41 v33.27,73.66
  Bottom 0.254: v33.27,73.66 33.27,88.39 43.69,98.81 77.72,98.81 80.26,96.27 JP3.11
LCD_DB4  (via drill 0.6)
  Top 0.254: IC4.74 41.49,70.02 41.27,70.23 37.85,70.23 34.54,73.53 v34.54,74.55
  Bottom 0.254: v34.54,74.55 34.54,88.9 43.94,98.3 77.47,98.3 78.99,96.77 78.99,93.34 JP3.12
LCD_DB5  (via drill 0.6)
  Top 0.254: IC4.73 41.99,70.41 41.53,70.87 38.73,70.87 v35.81,73.66
  Bottom 0.254: v35.81,73.66 35.81,89.41 44.2,97.79 76.45,97.79 77.72,96.52 JP3.13
LCD_DB6  (via drill 0.6)
  Top 0.254: IC4.72 42.49,70.67 41.78,71.37 39.24,71.37 37.08,73.53 v37.08,74.55
  Bottom 0.254: v37.08,74.55 37.08,89.92 44.45,97.28 74.93,97.28 76.45,95.76 76.45,93.34 JP3.14
LCD_DB7  (via drill 0.6)
  Top 0.254: IC4.71 42.99,70.93 42.04,71.88 40.26,71.88 v38.48,73.66
  Bottom 0.254: v38.48,73.66 38.48,90.55 44.7,96.77 73.02,96.77 JP3.15
LCD_DB8
  Top 0.254: IC4.60 48.49,73.68 44.45,77.72 40.13,77.72 37.34,80.52 37.34,91.95 45.47,100.08 69.85,100.08 73.91,96.01 73.91,93.34 JP3.16
LCD_DB9
  Top 0.254: IC4.59 48.99,73.95 44.7,78.23 40.39,78.23 37.85,80.77 37.85,91.69 45.72,99.57 69.6,99.57 72.64,96.52 JP3.17
LCD_DB10
  Top 0.254: IC4.58 49.49,74.21 44.96,78.74 40.64,78.74 38.35,81.03 38.35,91.44 45.97,99.06 69.09,99.06 71.37,96.77 71.37,93.34 JP3.18
LCD_DB11
  Top 0.254: IC4.57 49.99,74.47 45.21,79.25 40.89,79.25 38.86,81.28 38.86,91.19 46.23,98.55 67.56,98.55 70.1,96.01 JP3.19
LCD_DB12
  Top 0.254: IC4.56 50.49,74.73 45.47,79.76 41.15,79.76 39.37,81.53 39.37,90.93 46.48,98.04 67.31,98.04 68.83,96.52 68.83,93.34 JP3.20
LCD_DB13
  Top 0.254: IC4.55 50.99,74.99 45.72,80.26 41.4,80.26 39.88,81.79 39.88,90.68 46.74,97.54 67.06,97.54 67.56,97.03 JP3.21
LCD_DB14
  Top 0.254: IC4.54 51.49,75.26 45.97,80.77 41.66,80.77 40.39,82.04 40.39,90.42 46.99,97.03 65.28,97.03 66.29,96.01 66.29,93.34 JP3.22
LCD_DB15
  Top 0.254: IC4.53 51.99,75.52 46.23,81.28 41.91,81.28 40.89,82.3 40.89,90.17 47.24,96.52 63.12,96.52 JP3.23
LCD_DS  (via drill 0.6)
  Top 0.254: IC4.79 37.41,65.46 27.94,74.93 v27.94,81.53
  Bottom 0.254: v27.94,81.53 27.94,86.11 42.67,100.84 79.5,100.84 84.07,96.27 88.77,96.27 JP3.3
LCD_EN  (via drill 0.6)
  Top 0.254: IC7.1 56.17,10.51 54.99,11.68 v46.61,11.68 | v46.61,14.22 46.61,16.51 40.26,22.86 27.56,22.86 25.53,20.83 13.21,20.83 10.92,23.11 10.92,30.99 10.79,31.11 v9.91,31.11 R7.2 | v12.95,30.61 13.46,30.61 13.84,30.99 15.25,30.99 IC1.32
  Bottom 0.254: v46.61,14.22 v46.61,11.68 | v9.91,31.11 12.45,31.11 v12.95,30.61
LCD_RD
  Top 0.254: IC4.68 44.49,71.08 35.81,79.76 35.81,92.71 44.7,101.6 70.61,101.6 74.68,97.54 85.85,97.54 87.88,95.5 JP3.5
LCD_RESET
  Top 0.254: IC4.66 45.49,71.6 36.83,80.26 36.83,92.2 45.21,100.58 70.1,100.58 74.17,96.52 83.44,96.52 JP3.7
LCD_WR
  Top 0.254: IC4.69 43.99,70.82 35.31,79.5 35.31,92.96 44.45,102.11 70.87,102.11 74.93,98.04 86.61,98.04 89.15,95.5 89.15,93.34 JP3.4
LCD_XL  (via drill 0.6)
  Top 0.254: IC4.96 41.21,56.96 v42.16,57.91
  Bottom 0.254: v42.16,57.91 42.55,58.29 45.21,58.29 45.97,59.05 45.97,63.37 52.96,70.36 52.96,73.53 46.99,79.5 46.99,89.03 50.55,92.58 55.37,92.58 JP3.29
LCD_XR  (via drill 0.6)
  Top 0.254: IC4.94 40.31,57.96 40.64,58.29 40.64,59.56 v42.29,61.21
  Bottom 0.254: v42.29,61.21 44.32,61.21 44.96,61.85 44.96,63.88 51.94,70.87 51.94,73.03 45.21,79.76 40.77,79.76 39.75,80.77 39.75,87 45.85,93.09 53.59,93.09 56.39,95.89 58.67,95.89 JP3.27
LCD_YB  (via drill 0.6)
  Top 0.254: IC4.95 40.95,57.46 41.15,57.66 41.15,58.8 41.78,59.44 42.42,59.44 v42.55,59.56 | v46.99,91.82 55.24,91.82 56.77,93.34 58.67,93.34 JP3.28
  Bottom 0.254: v42.55,59.56 44.7,59.56 45.47,60.33 45.47,63.63 52.45,70.61 52.45,73.28 45.47,80.26 41.02,80.26 40.26,81.03 40.26,86.74 45.34,91.82 v46.99,91.82
LCD_YT  (via drill 0.6)
  Top 0.254: IC4.97 42.74,56.46 v43.43,57.15
  Bottom 0.254: v43.43,57.15 44.83,57.15 46.48,58.8 46.48,63.12 53.47,70.1 53.47,73.79 47.5,79.76 47.5,88.77 50.8,92.08 JP3.30
LI-ION_1  (via drill 0.7)
  Top 0.508: IC17.3 75.49,7.29 v74.3,6.1 | IC16.1 IC16.2 IC16.3 77.47,13.34 v77.6,13.21
  Bottom 0.508: J9.1 66.67,3.94 67.56,4.83 73.03,4.83 v74.3,6.1 | v77.6,13.21 77.6,11.18 74.8,8.38 | v74.3,6.1 74.17,6.22 | R32.1 70.06,13.12 74.8,8.38 | 74.8,8.38 74.8,6.6 v74.3,6.1
LI-ION_2
  Top 0.508: R34.1 J10.1 81.92,8.13 81.45,8.6 IC17.8
  Bottom 0.508: J10.1 R33.2
MAIN_3V3  (via drill 0.7)
  Top 0.305: IC11.3 66.29,19.68 v67.06,20.45 66.17,21.34 C20.1 | C20.1 57.37,18.54 R25.2 | C20.1 57.37,22.14 56.9,22.61 53.94,22.61 IC6.8
  Bottom 0.508: v67.06,20.45 67.06,20.57 66.42,21.21 64.45,21.21 C32.1
MAIN_5V  (via drill 0.7)
  Top 0.508: IC11.1 59.93,18.43 60.71,17.65 v60.83,17.65 | IC10.3 72.5,21.6 v72.14,21.97
  Bottom 0.508: C30.1 70.17,21.59 | C31.1 60.2,19.56 61.34,18.41 | 61.34,18.41 66.99,18.41 C30.1 | v60.83,17.65 60.83,17.91 61.34,18.41 | v72.14,21.97 72.14,21.84 71.63,21.34 69.91,21.34 C30.1
MAIN_BATT  (via drill 0.7)
  Top 0.508: IC18.3 IC18.2 IC18.1 66.67,10.54 | 66.67,10.54 66.93,10.79 67.94,10.79 69.22,12.06 IC15.5 IC15.6 IC15.7 IC15.8 71.75,16.76 72.39,17.4 | 66.67,10.54 61.69,10.54 IC7.4 | IC7.4 61.3,8.89 | 72.39,17.4 92.46,17.4 | 92.46,17.4 102.49,17.4 103.12,18.03 103.12,19.59 IC5.4 104.78,19.68 v105.28,20.19 | 72.39,17.4 73.91,18.92 73.91,19.59 IC10.4 v75.82,19.68 | 92.46,17.4 93.69,18.63 IC8.4 95.63,19.68 v95.89,19.43 | J19.1 61.85,8.35 IC7.4 | IC7.4 60.58,9.62 60.58,11.18 58.8,12.95 22.86,12.95 22.23,13.59 R1.2
  Bottom 0.508: v95.89,19.43 95.82,19.43 C25.1 | v105.28,20.19 105.28,22.42 C18.1 | v75.82,19.68 75.82,19.75 C29.1 | C23.1 61.85,10.86 J19.1
MAIN_BATT_EN  (via drill 0.6)
  Top 0.254: IC10.1 69.5,23.33 68.2,24.64 68.2,26.54 67.18,27.56 57.91,27.56 57.66,27.3 57.66,26.54 v57.78,26.42 | v51.31,28.83 51.31,29.97 50.67,30.61 38.99,30.61 35.43,34.16 35.43,43.05 33.91,44.58 19.68,44.58 19.18,44.07 19.18,42.93 19.43,42.67 19.43,39.97 IC1.19
  Bottom 0.254: v57.78,26.42 53.85,26.42 51.44,28.83 v51.31,28.83
MISO_GAVR
  Top 0.254: IC4.22 51.49,50.49 53.47,48.51 71.25,48.51 72.14,49.4 72.14,59.18 73.28,60.33 JP2.3
MISO_WAVR  (via drill 0.6)
  Top 0.254: IC1.2 28.73,31.09 28.96,30.86 28.96,27.81 v29.59,27.18 | v30.73,16.64 30.8,16.7 IC3.3
  Bottom 0.254: v29.59,27.18 30.73,26.04 v30.73,16.64 30.73,15.29 JP1.3
MOSI_GAVR
  Top 0.254: JP2.2 76.07,62.87 76.33,62.61 76.33,59.82 75.56,59.05 73.91,59.05 72.64,57.78 72.64,49.15 71.5,48.01 53.21,48.01 50.99,50.23 IC4.21
MOSI_WAVR  (via drill 0.6)
  Top 0.254: IC1.1 26.62,30.23 27.69,30.23 27.81,30.1 v27.81,29.21
  Bottom 0.254: v27.81,29.21 28.19,28.83 28.19,14.35 24.64,10.79 23.29,10.79 JP1.2
N$1  (via drill 0.6)
  Top 0.254: IC1.25 13.22,36.69 v12.7,37.21
  Bottom 0.254: C2.1 6.59,37.49 X1.2 10.44,37.21 v12.7,37.21
N$2  (via drill 0.6)
  Top 0.254: IC1.7 28.28,35.09 v28.7,34.67
  Bottom 0.254: v28.7,34.67 31.27,34.67 X2.P$2 32.48,33.56 33.91,32.13 36.16,32.13 C8.1
N$3  (via drill 0.6)
  Top 0.254: IC1.8 28.52,35.89 v28.96,36.32
  Bottom 0.254: v28.96,36.32 31.15,36.32 X2.P$1 36.08,37.56 C7.1
N$4  (via drill 0.6)
  Top 0.254: IC1.44 26.05,28.69 v26.29,28.45
  Top 0.305: R3.1 26.58,17.91 v27.05,17.91 28.32,17.91 IC3.1
  Bottom 0.254: v26.29,28.45 27.05,27.69 v27.05,17.91
N$5  (via drill 0.6)
  Top 0.254: IC4.28 55.67,55.96 v56.77,54.86
  Bottom 0.254: v56.77,54.86 58.77,54.86 X4.1 59.05,52.92 C16.1
N$6
  Top 0.254: LD8.A R11.2
N$7
  Top 0.305: R25.1 53.38,18.41 R26.2 52.7,17.91 50.04,20.57 47.12,20.57 IC6.3
N$8
  Top 0.254: LD9.A R12.2
N$9  (via drill 0.6)
  Top 0.305: IC6.4 47.06,18.87 v46.99,18.8
  Bottom 0.305: v46.99,18.8 48.02,18.8 R27.2
N$10  (via drill 0.6)
  Top 0.254: IC4.29 56.33,56.46 v56.52,56.64
  Bottom 0.254: v56.52,56.64 58.52,56.64 X4.2 59.05,58.84 C17.1
N$11
  Top 0.254: LD1.A R4.1
N$12
  Top 0.254: R8.1 35.58,20.12 LD5.A
N$13
  Top 0.254: LD6.A R9.1
N$14  (via drill 0.7)
  Top 0.406: IC17.2 76.89,7.95 77.47,7.37 77.47,5.08 v77.72,4.83
  Bottom 0.406: v77.72,4.83 77.22,4.83 76.71,5.33 76.71,6.26 R35.2
  Bottom 0.508: R33.1 77.69,8.47 76.58,7.37 76.58,6.39 R35.2
N$15
  Top 0.254: LD7.A R10.1
N$16
  Top 0.254: LD2.A R5.1
N$17
  Top 0.254: LD3.A R6.1
N$18
  Top 0.254: LD4.A R7.1
N$19  (via drill 0.6)
  Top 0.254: IC1.26 13.79,35.89 v13.46,35.56
  Bottom 0.254: v13.46,35.56 10.82,35.56 X1.1 6.59,34.9 C1.1
N$20  (via drill 0.6, 0.7)
  Top 0.305: T1.3 84.33,13.34 | IC14.1 91.05,9.77 91.06,9.78
  Top 0.406: v93.34,9.91 93.21,9.77
  Top 0.508: T1.3 T1.2 T1.1 | 84.33,13.34 v86.74,15.75 | 91.06,9.78 93.22,9.78 v93.34,9.91
  Bottom 0.305: R29.2 86.14,14.32 86.49,14.66
  Bottom 0.508: v93.34,9.91 93.85,10.41 93.85,14.22 93.09,14.99 86.81,14.99 | 86.81,14.99 86.14,14.32 | v86.74,15.75 86.74,15.06 86.81,14.99
N$21  (via drill 0.6)
  Top 0.254: IC4.34 61.05,58.96 v61.09,58.93
  Bottom 0.254: v61.09,58.93 61.09,59.05 62.48,60.45 64.74,60.45 | 64.74,60.45 X3.P$2 | 64.74,60.45 64.74,63.11 C15.1
N$22  (via drill 0.6)
  Top 0.254: IC4.33 59.27,58.46 60.45,57.28 v61.85,57.28
  Bottom 0.254: v61.85,57.28 63.91,57.28 X3.P$1 64.77,54.01 C14.1
N$24
  Top 0.254: R17.1 LD14.A
N$25
  Top 0.254: R16.1 LD13.A
N$26
  Top 0.254: R18.1 LD15.A
N$27
  Top 0.254: R13.1 LD10.A
N$28
  Top 0.254: LD20.A R23.1
N$29
  Top 0.254: R22.1 LD19.A
N$30
  Top 0.254: R21.1 LD18.A
N$31
  Top 0.254: R20.1 LD17.A
N$32
  Top 0.254: R19.1 LD16.A
N$33
  Top 0.254: IC14.2 IC14.3
  Top 0.305: 90.03,10.66 IC14.2
  Top 0.406: D1.C 90.03,10.66
  Bottom 0.508: 91.44,12.06 89.75,12.06 C36.1 89.19,11.5 R29.1 | 91.44,12.06 R30.2 | 91.44,12.06 D1.C
N$34  (via drill 0.6)
  Top 0.305: IC14.4 89.03,8.88
  Top 0.406: 89.03,8.88 89.53,8.38 93.09,8.38 v93.34,8.13
  Bottom 0.305: v93.34,8.13 91.53,8.13 R30.1
N$35
  Top 0.254: IC13.5 139.12,93.53 139.95,94.36 139.95,96.61 R28.1
N$36
  Top 0.254: LD21.A R28.2
N$37
  Top 0.254: R15.1 LD12.A
N$38
  Top 0.254: R14.1 LD11.A
N$39
  Top 0.305: C38.1 89.32,3.52 89.03,3.81 IC14.7
N$40
  Top 0.305: 83.69,11.93 T1.4 | 90.53,6.87 IC14.10
  Top 0.356: 90.53,6.87 90.04,7.37 84.2,7.37 83.69,7.87 83.69,11.93
N$43
  Top 0.508: R34.2 74.93,3.17 72.14,5.97 IC18.5 IC18.6 IC18.7 IC18.8
N$44  (via drill 0.7)
  Top 0.508: IC15.3 IC15.2 IC15.1 68.45,17.65 v68.45,17.78
  Bottom 0.508: R32.2 69.22,17.02 v68.45,17.78
N$49  (via drill 0.7)
  Top 0.406: v64.77,4.45 66.29,5.97
  Top 0.508: 66.29,5.97 IC18.4
  Bottom 0.406: v64.77,4.45 64.77,5.27 D2.1
RESET_GAVR  (via drill 0.6)
  Top 0.254: IC4.30 53.4,56.96 v52.7,56.26 | JP2.1 72.39,65.41 71.37,64.39 71.37,50.93 70.74,50.29 62.74,50.29 v62.1,49.66
  Bottom 0.254: v52.7,56.26 54.48,56.26 55.63,55.12 55.63,50.93 56.9,49.66 v62.1,49.66
RESET_WAVR  (via drill 0.6)
  Top 0.254: IC1.4 26.5,32.64 v24,32.64
  Bottom 0.254: v24,32.64 24.13,32.51 27.81,32.51 28.96,31.37 28.96,30.1 30.48,28.57 33.27,28.57 33.66,28.19 33.66,7.62 33.02,6.99 20.75,6.99 JP1.1
RX0_GAVR/TX4_BONE
  Top 0.254: IC2.P9_13 64.14,34.42 63.25,33.53 60.71,33.53 60.33,33.91 60.33,38.48 59.31,39.5 48.51,39.5 41.49,46.52 IC4.2
RX0_WAVR/TX1_BONE  (via drill 0.6)
  Top 0.254: IC1.9 27.67,36.69 32.89,41.91 v33.53,41.91 | IC2.P9_24 78.11,36.2 78.11,34.04 77.47,33.4 74.17,33.4 72.39,31.62 39.5,31.62 36.45,34.67 36.45,41.27 37.08,41.91 v37.34,41.91
  Bottom 0.254: v33.53,41.91 v37.34,41.91
RX1_GAVR/TX1_WAVR  (via drill 0.6)
  Top 0.254: IC1.12 25.54,39.89 v28.45,42.8 | v50.16,61.59 51.82,61.59 52.45,62.23 52.45,64.14 52.78,64.46 IC4.45
  Bottom 0.254: v50.16,61.59 50.93,60.83 50.93,53.59 48.64,51.31 44.45,51.31 38.99,45.85 30.35,45.85 28.45,43.94 v28.45,42.8
RX2_GAVR/TX5_BONE
  Top 0.254: IC4.12 46.48,46.1 49.53,43.05 91.31,43.05 94.61,46.35 IC2.P8_37
SCK_GAVR
  Top 0.254: JP2.4 75.82,57.78 77.09,56.52 77.09,52.83 71.75,47.5 52.96,47.5 50.49,49.97 IC4.20
SCK_WAVR  (via drill 0.6)
  Top 0.254: IC1.3 29.2,31.89 29.59,31.5 29.59,28.83 31.24,27.18 v32,27.18 | v32.13,21.59 31.43,20.89 IC3.4
  Bottom 0.254: v32,27.18 32.13,27.05 v32.13,21.59 32.13,14.55 JP1.4
SLEEP_LED  (via drill 0.6)
  Top 0.254: IC1.16 21.75,40.93 22.48,41.66 22.48,42.67 21.84,43.31 v20.32,43.31 | R12.1 10.29,41.27 v12.19,43.18
  Bottom 0.254: v12.19,43.18 18.67,43.18 18.8,43.31 v20.32,43.31
SPEED_INT  (via drill 0.6)
  Top 0.254: 44.07,55.63 v43.69,55.63 44.2,55.63 44.49,55.33 IC4.8
  Bottom 0.254: v43.69,55.63 43.69,53.51 R24.2 40.98,50.8 J8.1
STATUS_LED  (via drill 0.6)
  Top 0.254: IC1.21 17.75,41.38 v18.16,41.78 | 8.09,38.99 R11.1 10.03,38.73 10.41,39.12 v10.41,40.13
  Bottom 0.254: v18.16,41.78 12.06,41.78 v10.41,40.13
SWITCH_VIN  (via drill 0.7)
  Top 0.305: T1.8 89.29,16 | IC14.9 90.03,6.36 89.79,6.6
  Top 0.356: 89.79,6.6 87.5,6.6 v87,6.1
  Top 0.508: v87,8.89 87,11.18 87.76,11.94 89.03,11.94 T1.5 T1.6 T1.7 T1.8
  Bottom 0.356: v87,6.1 88.94,6.1 C37.1
  Bottom 0.508: v87,6.1 v87,8.89 85.98,9.91 83.4,9.91 R36.2
TCK
  Top 0.254: IC4.93 37.89,58.46 37.34,57.91 37.34,57.02 35.69,55.37 32.89,55.37 25.4,62.87 J1.6
TDI
  Top 0.254: J1.3 29.08,70.48 30.73,68.83 30.73,59.82 33.66,56.9 34.8,56.9 35.81,57.91 35.81,58.67 37.1,59.96 IC4.90
TDO
  Top 0.254: IC4.91 37.36,59.46 36.32,58.42 36.32,57.53 35.18,56.39 33.4,56.39 30.23,59.56 30.23,65.91 28.19,67.94 J1.4
TEMP_EN  (via drill 0.6)
  Top 0.254: IC1.40 21.75,27.52 21.84,27.43 21.84,25.91 23.75,24 v24,24 | v25.91,19.3 27.31,19.3 IC3.5 28.89,20.38 29.59,19.68 33.44,19.68 R8.2
  Bottom 0.254: v24,24 24,21.21 v25.91,19.3
TMS
  Top 0.254: IC4.92 37.62,58.96 36.83,58.17 36.83,57.28 35.43,55.88 33.15,55.88 26.29,62.74 26.29,63.63 J1.5
TX0_GAVR/RX4_BONE
  Top 0.254: IC2.P9_11 61.72,34.92 62.87,36.07 62.87,38.99 61.85,40.01 48.77,40.01 41.99,46.78 IC4.3
TX0_WAVR/RX1_BONE  (via drill 0.6)
  Top 0.254: IC1.10 27.46,37.49 32.51,42.55 32.51,43.05 v32.77,43.31 | IC2.P9_26 80.64,36.2 80.64,33.78 79.76,32.89 74.42,32.89 72.64,31.11 39.24,31.11 35.94,34.42 35.94,43.31 36.45,43.81 v36.7,43.81
  Bottom 0.254: v32.77,43.31 33.78,43.31 34.67,42.42 36.45,42.42 36.45,43.56 v36.7,43.81
TX1_GAVR/RX1_WAVR  (via drill 0.6)
  Top 0.254: IC1.11 26.55,38.37 v30.23,42.04 | v51.44,62.99 51.44,64.52 51.88,64.96 IC4.46
  Bottom 0.254: v30.23,42.04 30.23,44.96 30.61,45.34 39.24,45.34 44.7,50.8 48.9,50.8 51.44,53.34 v51.44,62.99
TX2_GAVR/RX5_BONE
  Top 0.254: IC4.13 46.99,46.35 49.78,43.56 91.06,43.56 94.11,46.61 94.11,80.77 93.34,81.53 93.34,84.71 94.36,85.72 IC2.P8_38
V_G  (via drill 0.7)
  Top 0.406: IC15.4 64.77,12.06 v64.39,11.68 | 74.8,11.3 74.8,10.12 IC17.1 | 74.8,11.3 74.8,11.94 | 74.8,11.3 74.17,10.67 69.98,10.67 69.09,9.78 v69.09,8.51
  Top 0.508: 74.8,11.94 IC16.4
  Bottom 0.406: v64.39,11.68 64.39,9.91 64.96,9.34 | 66.36,9.53 D2.2 66.23,9.27 68.58,9.27 69.09,8.76 v69.09,8.51
  Bottom 0.508: 64.96,9.34 D2.2
VCC_3V3_WAVR  (via drill 0.6)
  Top 0.254: 30.1,33.49 C3.1
  Top 0.305: IC6.7 51.36,21.28 v51.05,21.59 | IC1.38 20.16,27.6 v20.83,26.92 | R3.2 24.09,15.03 23.75,15.37 v23.75,19.3 23.5,19.56 | IC1.27 17.06,35.09 v17.27,35.31 | v20.95,41.78 IC1.17 20.95,34.8 21.97,33.78 24.64,33.78 24.93,33.49 IC1.5 30.1,33.49 | v35.56,28.19 31.24,28.19 30.35,29.08 30.35,33.57 C3.1 | JP1.6 31.75,10.92 31.11,11.56 21.72,11.56 v20.83,12.45
  Bottom 0.254: 20.83,25.74 C6.1 21.04,25.53 21.59,25.53 | v20.83,26.92 20.95,27.05 | 21.08,41.66 v20.95,41.78
  Bottom 0.305: C22.1 52.28,21.59 v51.05,21.59 51.05,21.97 50.67,22.35 41.4,22.35 v35.56,28.19 | 20.83,25.74 v20.83,26.92 | 21.59,25.53 22.73,24.38 22.73,19.68 23.11,19.3 v23.75,19.3 20.83,16.38 v20.83,12.45 | 17.27,34.29 17.27,29.21 17.78,28.7 20.45,28.7 20.95,28.19 20.95,27.05 | 17.27,34.29 v17.27,35.31 17.27,39.5 17.78,40.01 20.57,40.01 21.08,40.51 21.08,41.66 | C5.1 17.82,33.74 17.27,34.29 | v20.95,41.78 21.08,41.78 21.08,42.04 22.23,43.18 C4.1
VCC_12V
  Top 0.508: D1.A 102.23,10.16 101.6,9.53 IC12.3
  Bottom 0.508: C34.1 101.67,7.69 102.23,8.26 D1.A
WAVR_PCINT17  (via drill 0.6)
  Top 0.254: IC1.20 18.55,37.07 v18.8,36.83 | v32.38,63.75 32.64,64.01 39.19,64.01 IC4.82 | v29.34,49.15 27.18,49.15 v25.78,50.55
  Bottom 0.254: v18.8,36.83 24.13,36.83 26.92,39.62 26.92,43.05 26.16,43.81 26.16,47.12 27.81,48.77 28.96,48.77 v29.34,49.15 | v32.38,63.75 31.62,62.99 31.62,55.63 26.8,50.8 26.04,50.8 v25.78,50.55
WAVRI2/BBO  (via drill 0.6)
  Top 0.254: IC1.42 23.37,28.68 23.37,26.54 24,25.91 41.78,25.91 43.56,27.69 53.59,27.69 56.52,30.61 74.55,30.61 75.69,31.75 v75.69,32 | v77.72,48.64 79.76,50.67 79.76,51.44 81.41,53.09 83.19,53.09 85.98,55.88 85.98,60.07 72.14,73.91 64.26,73.91 57.28,80.9 52.83,80.9 51.44,82.3 IC2.P8_3
  Bottom 0.254: v75.69,32 75.56,32.13 75.56,39.37 77.72,41.53 v77.72,48.64
WIO0/BB8_9  (via drill 0.6)
  Top 0.254: 38.35,38.23 v38.48,38.23 38.23,38.48 38.23,43.56 36.7,45.09 18.03,45.09 16.76,43.81 16.76,40.08 IC1.22 | IC2.P8_9 59.82,82.42 59.82,81.41 65.28,75.95 73.15,75.95 88.01,61.09 88.01,54.86 80.77,47.62 76.45,47.62 v76.07,48.01
  Bottom 0.254: v76.07,48.01 76.07,46.48 74.8,45.21 52.2,45.21 47.62,40.64 43.81,40.64 41.53,38.35 38.61,38.35 v38.48,38.23
WIO1/BB8_10  (via drill 0.6)
  Top 0.254: IC1.23 15.37,38.3 15.37,43.18 17.78,45.59 36.96,45.59 38.73,43.81 38.73,40.39 39.62,39.5 v39.75,39.5 | IC2.P8_10 60.33,84.45 60.33,81.66 65.53,76.45 73.41,76.45 88.52,61.34 88.52,54.61 81.03,47.12 75.06,47.12 74.42,47.75 v74.42,48.01
  Bottom 0.254: v74.42,48.01 74.42,46.35 73.79,45.72 51.94,45.72 47.37,41.15 43.31,41.15 41.66,39.5 v39.75,39.5
WIO2/BB8_11  (via drill 0.6)
  Top 0.254: IC1.24 15.33,37.47 14.1,37.47 13.84,37.72 13.84,42.42 17.53,46.1 37.21,46.1 41.27,42.04 v41.27,41.27 | v72.9,47.37 73.66,46.61 81.28,46.61 89.03,54.36 89.03,61.59 73.66,76.96 65.79,76.96 61.59,81.15 IC2.P8_11
  Bottom 0.254: v72.9,47.37 72.9,47.12 72.01,46.23 51.69,46.23 47.12,41.66 41.66,41.66 v41.27,41.27
WIO3/GIO0  (via drill 0.6)
  Top 0.254: IC1.13 24.16,39.01 v23.11,37.97 | v34.04,57.91 34.29,58.17 34.29,59.69 35.05,60.45 IC4.89
  Bottom 0.254: v23.11,37.97 24.38,37.97 26.16,39.75 26.16,42.93 25.65,43.43 25.65,47.37 33.15,54.86 33.15,57.02 v34.04,57.91
WIO4/GIO1  (via drill 0.6)
  Top 0.254: IC1.14 23.36,40.88 24.26,41.78 v25.15,41.78 | v33.27,59.44 34.8,60.96 IC4.88
  Bottom 0.254: v25.15,41.78 25.15,47.62 32.64,55.12 32.64,58.8 v33.27,59.44
WIO5/GIO2  (via drill 0.6)
  Top 0.254: IC1.15 22.55,40.97 23.37,41.78 23.37,42.67 v23.75,43.05 | v32.77,60.71 32.77,60.96 33.27,61.47 IC4.87
  Bottom 0.254: v23.75,43.05 24.64,43.94 24.64,47.88 32.13,55.37 32.13,60.07 v32.77,60.71
WIO6/BB8_8  (via drill 0.6)
  Top 0.254: IC1.41 22.61,28.64 22.61,26.54 23.75,25.4 42.04,25.4 43.81,27.18 53.85,27.18 56.77,30.1 77.09,30.1 78.23,31.24 v78.23,32 | v79.25,48.64 81.03,48.64 87.5,55.12 87.5,60.83 72.9,75.44 65.02,75.44 57.78,82.68 57.78,84.33 56.52,85.6 IC2.P8_8
  Bottom 0.254: v78.23,32 78.11,32.13 78.11,38.73 79.25,39.88 v79.25,48.64

## Text on the board
tPlace: LCD Header | JTAG | Bri-Bri | GPS Header | GAVR Programmer | USB HERE | WAVR | Fee | Fi | Fo | Fum | BOO | - | BB | + | WAVR Programmer | Power | Oh-No | Orientation
bPlace: GPS Breakout | Brian Kane, Katherine Murphy | Ben Paolillo, Jiwon Song | Todd Sukolsky | March, 2013 Rev A
Document: 5.575" | 141.6mm | 4.45" | 1" | 113mm | 25.4mm | 1.05" | 4.05" | 102.87mm